# Altium project stand.PrjPcb
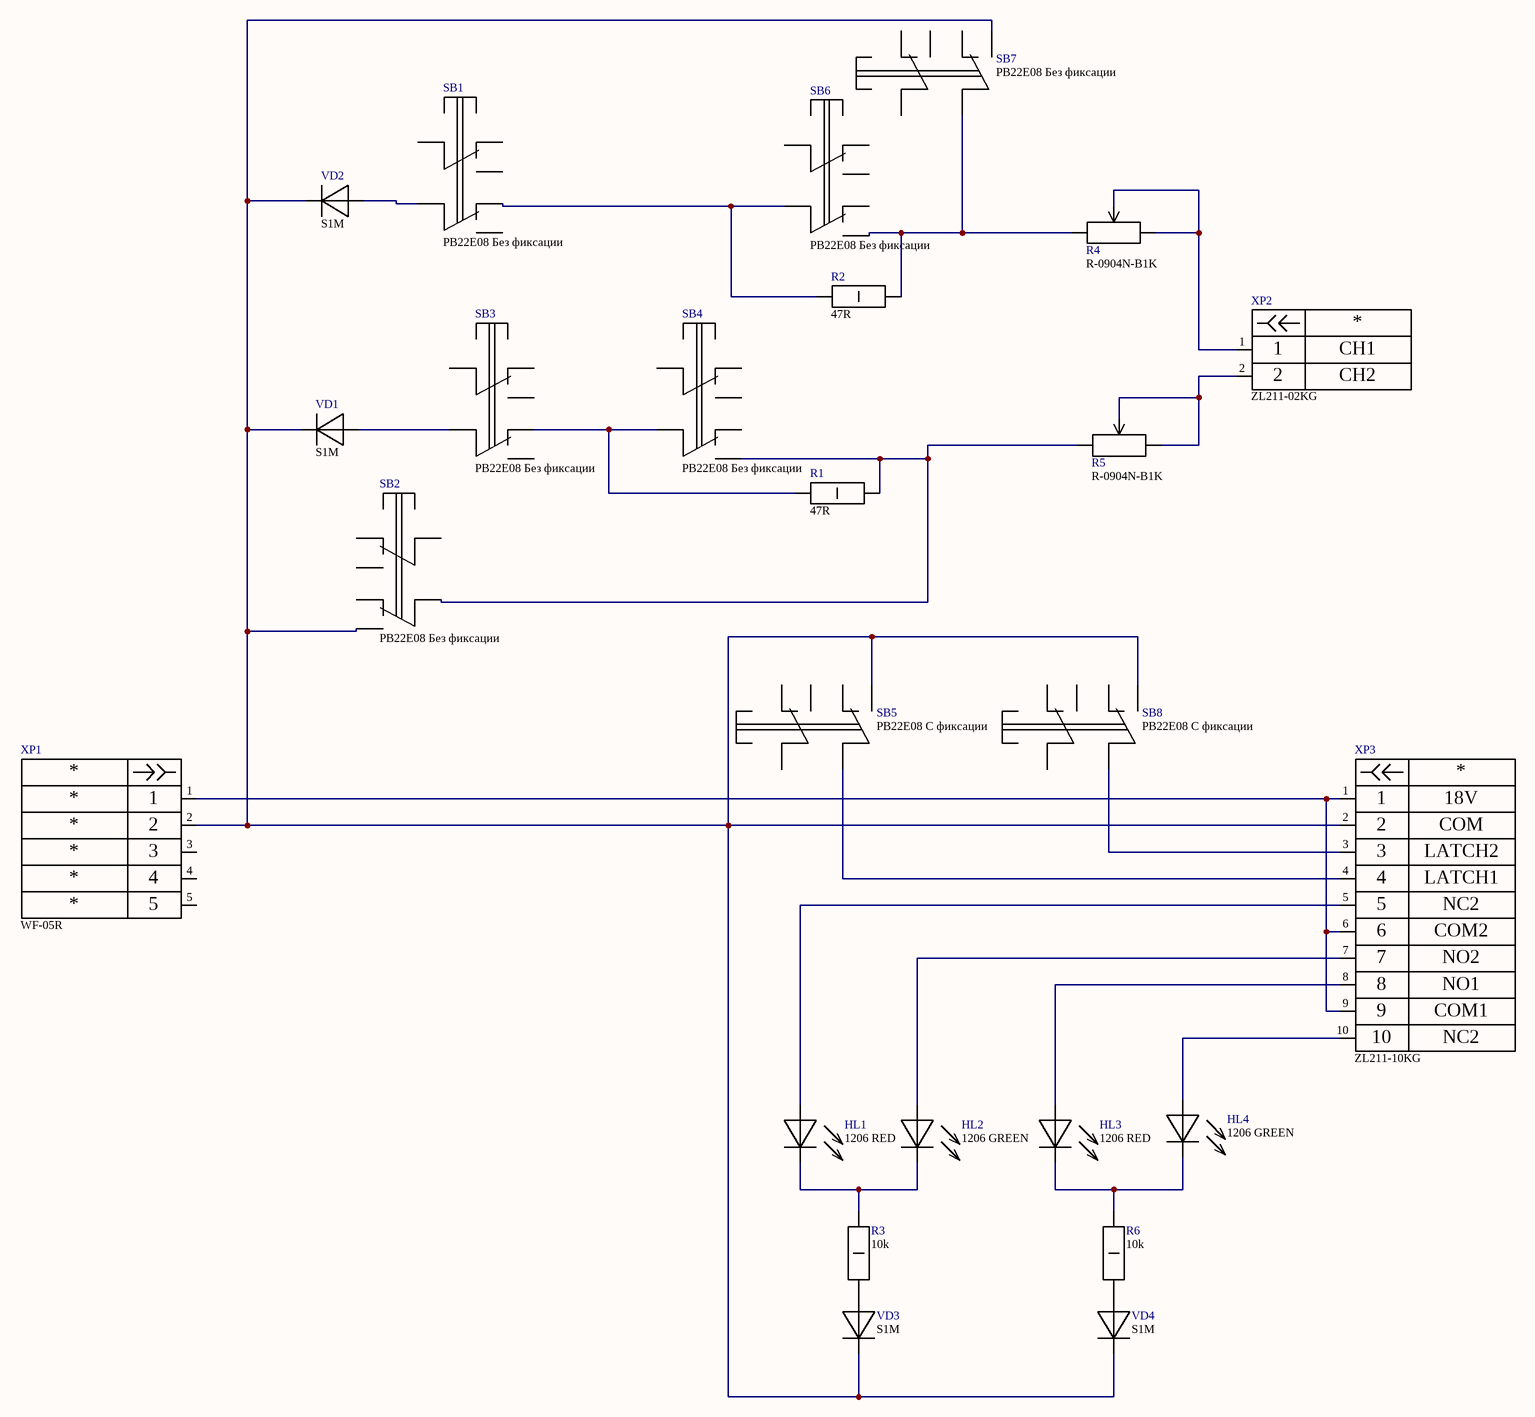
[diagram p0: Sheet_stand.SchDoc]
1 sheet, 25 parts. Net scope: global (net labels, ports and power ports of the same name join across sheets).
Board file: PCB_stand.PcbDoc

## Sheet Sheet_stand.SchDoc
size 420 x 297 mm; Razrabotal: {Разработал}; Prov: {Проверил}; Tkont: {Т. конт.}; Nkont: {Н. конт.}; Utv: {Утвердил}; Naimenovanie: {Наименование}; Oboznachenie: {Обозначение}; Shifr: {Шифр}

### Parts
HL1  1206 RED  [LED 0805]
HL2  1206 GREEN  [LED 0805]
HL3  1206 RED  [LED 0805]
HL4  1206 GREEN  [LED 0805]
R1  47R  [Resistor 2512]
R2  47R  [Resistor 2512]
R3  10k  [Resistor 2512]
R4  R-0904N-B1K  [R-0904N-B1K]
R5  R-0904N-B1K  [R-0904N-B1K]
R6  10k  [Resistor 2512]
SB1  PB22E08 Без фиксации  [PB22E08]
SB2  PB22E08 Без фиксации  [PB22E08]
SB3  PB22E08 Без фиксации  [PB22E08]
SB4  PB22E08 Без фиксации  [PB22E08]
SB5  PB22E08 C фиксации  [PB22E08]
SB6  PB22E08 Без фиксации  [PB22E08]
SB7  PB22E08 Без фиксации  [PB22E08]
SB8  PB22E08 C фиксации  [PB22E08]
VD1  S1M  [DO-214AC SMA]
VD2  S1M  [DO-214AC SMA]
VD3  S1M  [DO-214AC SMA]
VD4  S1M  [DO-214AC SMA]
XP1  WF-05R  [WF-05]
XP2  ZL211-02KG  Name1: CH1  Name2: CH2  [Pins 1x2]
XP3  ZL211-10KG  Name1: 18V  Name2: COM  Name3: LATCH2  Name4: LATCH1  Name5: NC2  Name6: COM2  Name7: NO2  Name8: NO1  Name9: COM1  [Pins 1x10]

### Nets
NetHL1_1: HL1.1(A) XP3.5
NetHL1_2: HL1.2(K) HL2.2(K) R3.2
NetHL2_1: HL2.1(A) XP3.7
NetHL3_1: HL3.1(A) XP3.8
NetHL3_2: HL3.2(K) HL4.2(K) R6.2
NetHL4_1: HL4.1(A) XP3.10
NetR1_1: R1.1 SB3.6 SB4.4
NetR1_2: R1.2 R5.1 SB2.4 SB4.5
NetR2_1: R2.1 SB1.6 SB6.4
NetR2_2: R2.2 R4.1 SB6.5 SB7.4
NetR3_1: R3.1 VD3.1(A)
NetR4_2: R4.2 R4.3 XP2.1
NetR5_2: R5.2 R5.3 XP2.2
NetR6_1: R6.1 VD4.1(A)
NetSB1_4: SB1.4 VD2.1(A)
NetSB2_5: SB2.5 SB5.5 SB7.5 SB8.5 VD1.2(K) VD2.2(K) VD3.2(K) VD4.2(K) XP1.2 XP3.2
NetSB3_4: SB3.4 VD1.1(A)
NetSB5_4: SB5.4 XP3.4
NetSB8_4: SB8.4 XP3.3
NetXP1_1: XP1.1 XP3.1 XP3.6 XP3.9

Not connected (* = marked no-connect by the designer): SB1 1 2 3 5; SB2 1 2 3 6; SB3 1 2 3 5; SB4 1 2 3 6; SB5 1 2 3 6; SB6 1 2 3 6; SB7 1 2 3 6; SB8 1 2 3 6; XP1 3 4 5

### Notes on the sheet
- Перв. примен.
- Спра. №
- Подп. и дата
- Инв. № бубл.
- Взам. инв. №
- Инв. № подл.
- Лист
- Изм
- № докум.
- Подпись
- Дата
- Копировал
- Формат А3

### Library data of the parts
HL1-HL4 = LED: Comments: *
R1-R3 R6 = Resistor 1W: Comments: *
SB1-SB4 SB6 SB7 = PB22E08(Non)
SB5 SB8 = PB22E08
XP1 = Pins 1x5: Comments: *; Name1: *; Name: *; Name2: *; Name3: *; Name4: *; Name5: *
XP2 = Pins 1x2: Comments: *; Name: *
XP3 = Pins 1x10: Comments: *; Name: *; Name10: NC2
VD1-VD4 = S1M: Comments: *